# EasyEDA Pro project 2025-07-08.epro, board PCB1
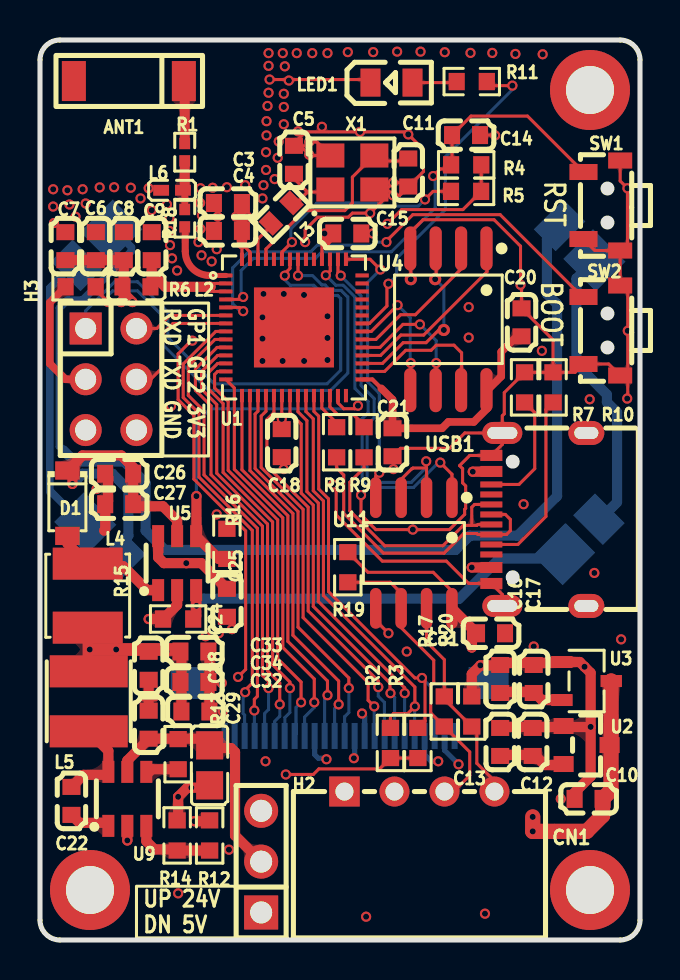
[diagram p1: board, top side]
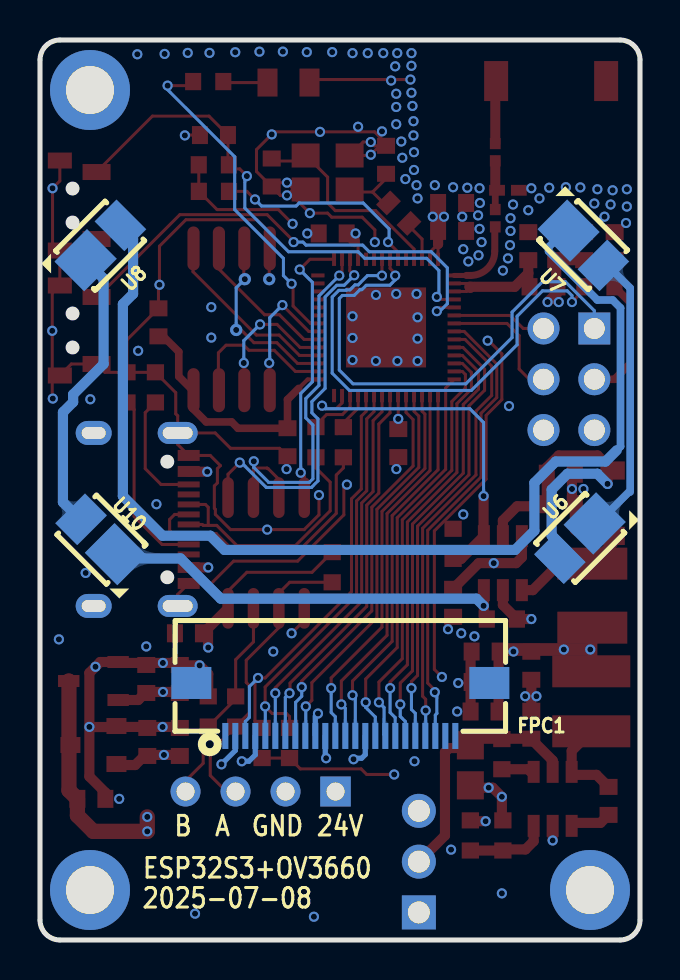
[diagram p2: board, bottom side, seen from below]

Outline 30 x 45 mm; copper layers: Top Layer, Inner1, Inner2, Bottom Layer. Coordinates in mm from the lower left corner of the outline.
Outline path: 0,44 0,1 arc(0.29,0.29) 1,0 29,0 arc(29.71,0.29) 30,1 30,44 arc(29.71,44.71) 29,45 1,45 arc(0.29,44.71) 0,44
Stack: Top Layer 0.035mm 外层铜厚1oz / Dielectric1 0.2104mm 7628 RC49% 8.6mil / Inner1 0.0152mm 内层铜厚 / Dielectric2 1.065mm 1.1mm H/HOZ 含铜 / Inner2 0.0152mm 内层铜厚 / Dielectric3 0.2104mm 7628 RC49% 8.6mil / Bottom Layer 0.035mm 外层铜厚1oz

## Design rules (mm)
net USB_D-: DP1
net USB_D+: DP1
template: 自定义配置
spacing copperThickness1oz (default): track to track 0.102, other pairs 0.152 to 0.3
spacing copperThickness2oz: track to track 0.203, other pairs 0.152 to 0.3
track width copperThickness1oz (default): min 0.127, default 0.254, max 2.54
track width copperThickness2oz: min 0.203, default 0.254, max 2.54
differential pair differentialPair (default): width min 0.127, default 0.254, max 2.54; gap min 0.152, default 0.152
via viaSize (default): diameter min 0.5, default 0.508, max 10; hole min 0.3, default 0.305, max 6.299

## Placement (name value [footprint] x y rotation side)
ANT1  -  [CA-C03]  4.44 42.95 180 top
C3  10nF  [C0603]  9.4 36.85 0 top
C4  1uF  [C0603]  9.4 35.45 0 top
C5  12pF  [C0603]  12.7 39.01 90 top
C6  10uF  [C0603]  2.79 34.69 270 top
C7  1uF  [C0603]  1.27 34.69 270 top
C8  100nF  [C0603]  4.19 34.69 270 top
C9  100nF  [C0603]  5.59 34.69 270 top
C10  10uF  [C0603]  27.43 7.06 0 top
C11  12pF  [C0603]  18.41 38.38 90 top
C12  100nF  [C0603]  24.64 9.9 270 top
C13  10uF  [C0603]  23.01 9.9 270 top
C14  1uF  [C0603]  21.3 40.25 180 top
C15  100nF  [C0603]  15.37 35.33 180 top
C16  100nF  [C0603]  23.01 13.05 270 top
C17  10uF  [C0603]  24.69 13.05 270 top
C18  100nF  [C0603]  12.09 24.84 90 top
C20  100nF  [C0603]  24.08 30.88 270 top
C21  1uF  [C0603]  17.63 24.89 90 top
C22  100nF  [C0603]  1.57 6.95 270 top
C24  10uF  [C0603]  5.43 13.71 90 top
C25  1uF  [C0603]  9.34 16.86 90 top
C26  1uF  [C0603]  3.96 23.31 0 top
C27  1uF  [C0603]  3.96 21.79 0 top
C28  100nF  [C0603]  5.43 10.77 90 top
C29  22uF  [C0805]  8.48 8.73 90 top
C31  100nF  [C0603]  22.55 15.34 0 top
C32  10uF  [C0603]  7.77 11.43 180 top
C33  10uF  [C0603]  7.72 14.42 180 top
C34  10uF  [C0603]  7.72 12.9 180 top
CN1  ZX-XH2.54-4PWZ  [CONN-TH_4P-P2.50_ZX-XH2.54-4PWZ]  18.97 7.42 0 top
D1  1N5819W  [SOD-123_L2.7-W1.6-LS3.7-RD]  1.37 21.84 270 top
FPC1  AFC01-S24FCA-00  [FPC-SMD_24P-P0.50_AFC01-S24FCA-00-R]  14.98 11.53 0 bottom
H2  PZ254V-11-03P  [HDR-TH_3P-P2.54-V-M]  11.06 3.92 90 top
H3  2.54-2*3  [HDR-TH_6P-P2.54-V-R2-C3-S2.54_A2541WV-2X3P]  3.55 28.04 270 top
L2  2nH  [L0603]  4.82 32.66 0 top
L3  24nH  [IND-SMD_L1.6-W0.8]  12.06 36.34 45 top
L4  22uH  [IND-SMD_L4.0-W4.0]  2.39 17.22 90 top
L5  10uH  [IND-SMD_L4.0-W4.0_FNR40XXS]  2.44 11.93 90 top
L6  3nH  [L0402]  6.6 37.49 0 top
LED1  NCD0805R1  [LED0805-R-RD]  17.57 42.87 0 top
NOREF  -  [Pad_e89]  27.5 42.5 0 top
NOREF#2  -  [Pad_e87]  2.5 2.5 0 top
NOREF#3  -  [Pad_e84]  27.5 2.5 0 top
R1  0Ω  [R0402]  7.24 39.39 270 top
R2  4.7kΩ  [R0603]  17.52 9.85 270 top
R3  4.7kΩ  [R0603]  18.9 9.85 270 top
R4  10kΩ  [R0603]  21.31 38.76 0 top
R5  10kΩ  [R0603]  21.3 37.43 0 top
R6  499Ω  [R0603]  2.03 32.66 180 top
R7  5.1kΩ  [R0603]  24.23 27.63 270 top
R8  22Ω  [R0603]  14.83 24.89 90 top
R9  22Ω  [R0603]  16.2 24.89 90 top
R10  5.1kΩ  [R0603]  25.65 27.63 270 top
R11  10kΩ  [R0603]  21.59 42.92 0 top
R12  7.5kΩ  [R0603]  8.48 5.23 90 top
R13  10kΩ  [R0603]  6.91 9.29 90 top
R14  2.4kΩ  [R0603]  6.86 5.23 270 top
R15  5.1Ω  [R0603]  6.91 16.05 0 top
R16  10kΩ  [R0603]  9.34 19.81 270 top
R17  120Ω  [R0603]  20.22 11.43 90 top
R18  0Ω  [R0402]  7.24 36.09 270 top
R19  1kΩ  [R0603]  15.39 18.64 90 top
R20  1kΩ  [R0603]  21.59 11.43 270 top
SW1  TS24CA 250gf 013  [SW-SMD_L4.7-W3.5-P3.35-EH]  28.09 36.72 270 top
SW2  TS24CA 250gf 013  [SW-SMD_L4.7-W3.5-P3.35-EH]  28.09 30.48 270 top
U1  ESP32-S3R8  [QFN-56_L7.0-W7.0-P0.40-TL-EP4.0]  12.7 30.63 0 top
U2  ME6206A28XG  [SOT-23_L2.9-W1.3-P1.90-LS2.4-BR]  27.33 9.75 180 top
U3  ME6206A15XG  [SOT-23-3_L2.9-W1.6-P1.90-LS2.8-BR]  27.33 12.95 180 top
U4  W25Q64JVSSIQ  [SOP-8_L5.3-W5.3-P1.27-LS8.0-BL]  20.42 31.03 180 top
U5  SY7200AABC  [SOT-23-6_L2.9-W1.6-P0.95-LS2.8-BR]  6.86 18.84 270 top
U6  A2835W6H2-D01-8D2AB5  [LED-SMD_L3.5-W2.8-FD-2835_WHITE]  3.14 19.96 135 bottom
U7  A2835W6H2-D01-8D2AB5  [LED-SMD_L3.5-W2.8-FD-2835_WHITE]  2.7 34.6 45 bottom
U8  A2835W6H2-D01-8D2AB5  [LED-SMD_L3.5-W2.8-FD-2835_WHITE]  26.85 34.86 315 bottom
U9  JW5026  [SOT-23-6_L2.9-W1.6-P0.95-LS2.8-BR]  4.37 7.06 270 top
U10  A2835W6H2-D01-8D2AB5  [LED-SMD_L3.5-W2.8-FD-2835_WHITE]  27.07 20.16 225 bottom
U11  SP3485EEN(UMW)  [SOP-8_L5.0-W4.0-P1.27-LS6.0-BL]  18.69 19.35 180 top
USB1  TYPE-C 16PIN 2MD(073)  [usb-c-smd_type-c-6pin-2md-073]  24.94 21.03 90 top
X1  40MHz  [CRYSTAL-SMD_4P-L3.2-W2.5-BL_SIT8008BI]  15.62 38.38 0 top

## Footprints (pads in the part's own frame, mm; a bottom-side part is the same pattern mirrored in y, then rotated)
C0603
  rect 0.8x0.9 smd: 1(-0.7,0) 2(0.7,0)
C0805
  rect 1.41x1.35 smd: 1(-1,0) 2(1,0)
CA-C03
  rect 1.2x2 smd: 1(-2.75,0) 2(2.75,0)
CONN-TH_4P-P2.50_ZX-XH2.54-4PWZ
  rect 1.524x1.5 hole 0.9: 1(-3.75,0)
  round 1.5 hole 0.9: 2(-1.25,0) 3(1.25,0) 4(3.75,0)
CRYSTAL-SMD_4P-L3.2-W2.5-BL_SIT8008BI
  rect 1.4x1.2 smd: 1(-1.1,-0.85) 2(1.1,-0.85) 3(1.1,0.85) 4(-1.1,0.85)
FPC-SMD_24P-P0.50_AFC01-S24FCA-00-R
  rect 0.3x1.3 smd: 1(5.75,1.325) 2(5.25,1.325) 3(4.75,1.325) 4(4.25,1.325) 5(3.75,1.325) 6(3.25,1.325) 7(2.75,1.325) 8(2.25,1.325) 9(1.75,1.325) 10(1.25,1.325) 11(0.75,1.325) 12(0.25,1.325) 13(-0.25,1.325) 14(-0.75,1.325) 15(-1.25,1.325) 16(-1.75,1.325) 17(-2.25,1.325) 18(-2.75,1.325) 19(-3.25,1.325) 20(-3.75,1.325) 21(-4.25,1.325) 22(-4.75,1.325) 23(-5.25,1.325) 24(-5.75,1.325)
  rect 2x1.6 smd: 25(7.449,-1.325) 26(-7.45,-1.325)
HDR-TH_3P-P2.54-V-M
  rect 1.7x1.7 hole 1.1: 1(-2.54,0)
  round 1.7 hole 1.1: 2(0,0) 3(2.54,0)
HDR-TH_6P-P2.54-V-R2-C3-S2.54_A2541WV-2X3P
  rect 1.6x1.6 hole 1.05: 1(-2.54,-1.27)
  round 1.6 hole 1.05: 2(-2.54,1.27) 3(0,-1.27) 4(0,1.27) 5(2.54,-1.27) 6(2.54,1.27)
IND-SMD_L1.6-W0.8
  rect 0.762x1 smd: 1(-0.724,0) 2(0.724,0)
IND-SMD_L4.0-W4.0
  rect 1.6x3.5 smd: 1(-1.6,0) 2(1.6,0)
IND-SMD_L4.0-W4.0_FNR40XXS
  rect 1.6x3.9 smd: 1(-1.5,0) 2(1.5,0)
L0402
  rect 0.79x0.54 smd: 1(-0.545,0) 2(0.545,0)
L0603
  rect 0.8x0.864 smd: 1(-0.7,0) 2(0.7,0)
LED0805-R-RD
  rect 1x1.399 smd: 1(1.05,0) 2(-1.05,0)
LED-SMD_L3.5-W2.8-FD-2835_WHITE
  rect 2.3x2.1 smd: 1(1.231,0)
  rect 1.55x2.1 smd: 2(-1.232,0)
Pad_e84
  round 4 hole 2.4: 1(0,0)
Pad_e87
  round 4 hole 2.4: 1(0,0)
Pad_e89
  round 4 hole 2.4: 1(0,0)
QFN-56_L7.0-W7.0-P0.40-TL-EP4.0
  rect 0.665x0.2 smd: 1(-3.408,2.6) 2(-3.408,2.2) 3(-3.408,1.8) 4(-3.408,1.4) 5(-3.408,1) 6(-3.408,0.6) 7(-3.408,0.2) 8(-3.408,-0.2) 9(-3.408,-0.6) 10(-3.408,-1) 11(-3.408,-1.4) 12(-3.408,-1.8) 13(-3.408,-2.2) 14(-3.408,-2.6) 29(3.408,-2.6) 30(3.408,-2.2) 31(3.408,-1.8) 32(3.408,-1.4) 33(3.408,-1) 34(3.408,-0.6) 35(3.408,-0.2) 36(3.408,0.2) 37(3.408,0.6) 38(3.408,1) 39(3.408,1.4) 40(3.408,1.8) 41(3.408,2.2) 42(3.408,2.6)
  rect 0.2x0.665 smd: 15(-2.6,-3.408) 16(-2.2,-3.408) 17(-1.8,-3.408) 18(-1.4,-3.408) 19(-1,-3.408) 20(-0.6,-3.408) 21(-0.2,-3.408) 22(0.2,-3.408) 23(0.6,-3.408) 24(1,-3.408) 25(1.4,-3.408) 26(1.8,-3.408) 27(2.2,-3.408) 28(2.6,-3.408) 43(2.6,3.408) 44(2.2,3.408) 45(1.8,3.408) 46(1.4,3.408) 47(1,3.408) 48(0.6,3.408) 49(0.2,3.408) 50(-0.2,3.408) 51(-0.6,3.408) 52(-1,3.408) 53(-1.4,3.408) 54(-1.8,3.408) 55(-2.2,3.408) 56(-2.6,3.408)
  rect 4x4 smd: 57(0,0)
R0402
  rect 0.566x0.54 smd: 1(-0.433,0) 2(0.433,0)
R0603
  rect 0.806x0.864 smd: 1(-0.753,0) 2(0.753,0)
SOD-123_L2.7-W1.6-LS3.7-RD
  rect 0.91x1.22 smd: 1(-1.635,0) 2(1.635,0)
SOP-8_L5.0-W4.0-P1.27-LS6.0-BL
  oval 0.574x2.035 smd: 1(-1.905,-2.768) 2(-0.635,-2.768) 3(0.635,-2.768) 4(1.905,-2.768) 5(1.905,2.768) 6(0.635,2.768) 7(-0.635,2.768) 8(-1.905,2.768)
SOP-8_L5.3-W5.3-P1.27-LS8.0-BL
  oval 0.609x2.204 smd: 1(-1.905,-3.542) 2(-0.635,-3.542) 3(0.635,-3.542) 4(1.905,-3.542) 5(1.905,3.542) 6(0.635,3.542) 7(-0.635,3.542) 8(-1.905,3.542)
SOT-23-3_L2.9-W1.6-P1.90-LS2.8-BR
  rect 1.07x0.6 smd: 1(1.235,-0.95) 2(1.235,0.95) 3(-1.235,0)
SOT-23-6_L2.9-W1.6-P0.95-LS2.8-BR
  rect 1.1x0.6 smd: 1(1.35,-0.95) 2(1.35,0) 3(1.35,0.95) 4(-1.35,0.95) 5(-1.35,0) 6(-1.35,-0.95)
SOT-23_L2.9-W1.3-P1.90-LS2.4-BR
  rect 1x0.8 smd: 1(1.15,-0.95) 2(1.15,0.95) 3(-1.15,0)
SW-SMD_L4.7-W3.5-P3.35-EH
  rect 0.8x1.4 smd: 1(-1.675,-0.917) 2(1.675,-0.917)
  rect 0.8x1.2 smd: 3(-2.25,0.917) 4(2.25,0.917)
usb-c-smd_type-c-6pin-2md-073
  rect 0.55x1.1 smd: 1(-3.2,2.375) 2(-2.4,2.375) 11(2.4,2.375) 12(3.2,2.375)
  rect 0.3x1.1 smd: 3(-1.75,2.375) 4(-1.25,2.375) 5(-0.75,2.375) 6(-0.25,2.375) 7(0.25,2.375) 8(0.75,2.375) 9(1.25,2.375) 10(1.75,2.375)
  oval 1.1x2 hole 0.6x1.5: 13(-4.325,1.825) 14(4.325,1.825)
  oval 1.2x1.8 hole 0.6x1.2: 13(-4.325,-2.375) 14(4.325,-2.375)

## Nets
As in the schematic, except:
GND: C3.1 C4.1 C5.2 C6.1 C7.1 C8.1 C9.1 C10.1 C11.1 C12.1 C13.1 C14.1 C15.1 C16.1 C17.1 C18.1 C20.1 C21.1 C24.1 C25.1 C26.1 C27.1 C28.2 C29.1 C31.2 C32.1 C33.1 C34.1 CN1.2 FPC1.2 FPC1.15 FPC1.25 FPC1.26 H3.5 L6.1 LED1.2 NOREF.1 NOREF#2.1 NOREF#3.1 R7.1 R10.1 R14.1 R15.1 R16.1 R20.1 SW1.2 SW1.3 SW1.4 SW2.2 SW2.3 SW2.4 U1.57 U2.1 U3.1 U4.4 U5.2 U9.2 U11.5 USB1.1 USB1.12 USB1.13 USB1.14 X1.2 X1.4

Pads without a net: ANT1 2; FPC1 1 23 24; U1 28 37 38 39 40 41 42 47 48 52; USB1 3 9

## Via types
v1: diameter 0.508, hole 0.305, Top Layer to Bottom Layer, 157 vias
v2: diameter 0.508, hole 0.299, Top Layer to Bottom Layer, 43 vias
v3: diameter 0.61, hole 0.305, Top Layer to Bottom Layer, 3 vias

## Routing (per net, layer and track width the routed paths; a pad name or vN(x,y) marks a point on that pad's centre or on a via; arc(x,y) is an arc through that point)
5V: length 1.9
  Top Layer w0.508: v2(21.64,23.41) 22.55,23.41 USB1.11 ; v2(21.59,18.63) USB1.2
24V_5V: length 12.9
  Top Layer w0.508: H2.2 9.75,5.22 9.75,9.39 9.55,9.6 8.62,9.6 C29.2 8.15,10.06 C28.1 5.43,10.04 4.37,8.97 4.37,8.26
GND: length 156.2
  Top Layer w0.152: USB1.13 23.12,17.28 USB1.1 21.44,17.83 20.32,18.94 17.12,18.94 14.81,21.25 14.81,22.62 v1(14.66,22.77) ; v1(17.65,37.23) 17.4,37.23 v1(16.51,36.34) 15.62,36.34 15.42,36.14 13.89,36.14 13.26,35.5 v1(13.26,34.89) ; v1(17.65,37.23) 17.97,37.23 ; v1(17.65,37.23) 17.36,37.53 17.31,37.53 ; LED1.2 16.37,43.02 v1(11.48,43.02) ; R10.1 25.65,30.01 C20.1 24.08,32.71 v2(24.03,32.76) 24.03,34.69 22.71,36.01 19.15,36.01 18.48,35.35 18.48,33.57 ; R10.1 26.76,28.38 SW2.2 28.43,28.8 SW2.4 ; R10.1 R7.1 23.21,27.37 23.21,26.31 23.12,26.21 USB1.14 ; C14.1 22.74,40.25 v1(22.76,40.23) ; v2(9.09,12.85) 8.47,12.85 C34.1 ; U11.5 16.79,15.97 v1(17.42,15.34) ; 13.01,39.71 13.27,39.71 v1(13.46,39.9) 13.84,39.9 X1.4 13.5,39.22 v1(13.46,39.26) 13.01,39.71 ; 13.01,39.71 12.57,39.71 13.27,40.41 v1(16,40.41) 18.29,40.41 v1(18.41,40.28) 19.18,39.52 19.18,38.43 17.98,37.23 17.97,37.23 ; 17.97,37.23 C11.1 18.22,37.87 v1(17.65,37.87) 17.31,37.53 ; SW1.4 SW2.3 29.39,32.35 v1(29.39,30.46) 29.39,27.1 v1(29.36,27.07) ; SW1.4 27.75,34.47 SW1.2 ; SW1.4 29.37,34.84 v1(29.37,37.59) 29.01,37.95 SW1.3 ; C21.1 18.02,24.58 20.47,24.58 21.24,25.35 USB1.14 ; 17.31,37.53 X1.2 ; v2(9.9,13.15) 10.28,13.53 10.28,20.45 7.69,23.04 7.69,26.23 6.91,27.02 6.91,29.31 7.57,29.97 v1(7.62,29.97) ; USB1.14 23.12,24.78 USB1.12 21.49,24.23 20.98,23.72 21.13,23.57 21.13,22.86 21.28,22.7 21.28,21.59 21.23,21.53 21.23,21.28 20.47,20.52 v1(18.64,20.52) 16.79,20.52 16.05,21.26 v1(16.05,22.25) ; v3(18.54,33.04) 18.54,34.55
  Top Layer w0.508: R14.1 6.91,6.03 v2(6.91,7.16) 7.36,7.62 v2(7.57,7.62) 8.36,7.62 C29.1 ; v1(27.53,10.66) 27.53,10.65 26.25,10.65 26.24,10.65 v1(23.87,10.65) 23.01,10.65 ; v1(27.53,10.66) 27.53,13.36 v1(27.23,13.66) 26.99,13.9 26.19,13.9 26.15,13.85 v1(23.86,13.85) 22.96,13.85 22.84,13.73 v1(22.02,13.73) 21.59,13.3 R20.1 ; v1(27.53,10.66) 27.53,8.17 26.73,7.37 C10.1 ; v2(5.43,16.05) R15.1 6.86,16.75 U5.2 ; 3.21,20.47 3.26,20.52 C27.1 3.4,21.93 v1(3.4,22.55) 3.4,23.17 C26.1 ; v2(4.37,4.98) 4.37,5.86 ; C32.1 8.47,14.37 C33.1 ; C24.1 C28.2
  Bottom Layer w0.254: v1(20.93,8.78) 20.23,9.48 FPC1.2 ; v1(14.32,9.04) 14.27,9.09 13.92,9.09 13.73,9.27 FPC1.15
  vias: v1(0.66,37.54) v1(0.66,36.67) v1(0.7,35.85) v1(1.37,37.49) v1(1.47,36.78) v1(1.78,36.17) v1(2.13,37.54) v1(2.28,36.83) v1(2.83,22.55) v1(2.98,37.63) v1(3.71,37.64) v1(4.54,37.61) v1(5.03,37.08) v1(5.43,37.59) v1(5.59,36.49) v1(6.35,36.78) v1(6.47,36.09) v1(6.47,35.45) v1(6.5,34.74) v1(6.6,34.08) v1(6.55,26.7) v1(6.86,33.47) v1(6.91,2.33) v1(7.92,34.89) v1(8.02,37.59) v1(8.01,36.85) v1(8.02,35.56) v1(8.1,36.23) v1(8.07,34.23) v1(8.63,37.61) v1(8.58,33.93) v1(8.84,34.54) v1(8.84,21.28) v1(8.89,36.17) v1(9.14,11.43) v1(9.34,37.64) v1(9.45,4.52) v1(10.26,37.74) v1(11.12,37.08) v1(11.12,30.07) v1(11.12,28.95) v1(11.17,37.74) v1(11.33,40.94) v1(11.33,40.23) v1(11.3,39.39) v1(11.3,38.5) v1(11.28,8.94) v1(11.43,44.34) v1(11.43,43.71) v1(11.43,42.36) v1(11.38,41.7) v1(11.73,38.05) v1(11.94,39.92) v1(11.88,39.11) v1(12.14,44.34) v1(12.13,28.95) v1(12.24,43.68) v1(12.19,42.31) v1(12.19,41.65) v1(12.19,40.79) v1(12.19,32.3) v1(12.18,23.55) v1(12.44,42.97) v1(12.84,44.34) v1(12.9,40.43) v1(13.2,32.25) v1(13.21,28.95) v1(13.61,44.34) v1(14.09,40.66) v1(14.37,44.34) v1(14.37,31.19) v1(14.37,30.1) v1(14.37,29) v1(15.39,44.39) v1(16.31,1.16) v1(16.63,35.33) v1(16.66,44.39) v1(17.67,23.54) v1(17.86,44.42) v1(18.34,14.42) v1(19.03,44.42) v1(20.24,44.39) v1(21.44,31.64) v1(21.53,44.35) v1(22.25,1.32) v1(22.61,44.35) v1(23.77,44.3) v1(24.18,21.79) v1(24.69,14.68) v1(25.13,44.29) v1(25.09,29.46) v1(26.04,7.06) v1(29.06,15.03) v2(5.18,12.19) v2(5.74,12.19) v2(8.28,15.19) v2(8.94,15.34) v2(9.6,15.54) v2(11.12,31.14) v2(11.17,32.3) v2(21.44,30.12) v2(27.49,27.04) v2(27.72,18.35)
VDD3P3: length 6.8
  Top Layer w0.152: 8.49,32.61 8.67,32.43 U1.3 ; 8.44,32.66 8.27,32.83 U1.2
  Top Layer w0.508: 8.49,32.61 8.48,32.62 8.52,32.66 6.26,32.66 5.59,33.34 ; 5.59,33.34 5.59,32.72 L2.2 ; 5.59,33.34 C9.2
VDD_SPI: length 13
  Top Layer w0.203: 17.07,27.58 16.62,28.03 U1.29
  Top Layer w0.381: C20.2 23.83,30.18 23.06,29.41 23.06,28.18 22.35,27.47 22.35,26.56 21.69,25.9 20.42,25.9 20.1,25.59 C21.2 17.63,27.02 17.07,27.58
1P5V: length 4.6
  Top Layer w0.508: 26.19,12 25.09,12 24.69,12.4 v1(23.85,12.4) 23.01,12.4 22.96,12.45
  Bottom Layer w0.254: v2(16.1,11.32) 16.23,11.19 FPC1.10
2P8V: length 6.4
  Top Layer w0.508: 23.01,9.25 v1(23.8,9.25) 24.64,9.25 24.69,9.3 25.24,8.75 26.25,8.75
  Bottom Layer w0.254: v2(19.91,8.94) 19.56,8.94 19.23,9.26 FPC1.4 ; v2(15.69,9.09) 15.73,9.13 FPC1.11
3P3V: length 65
  Top Layer w0.152: v1(10.36,36.17) 10.36,36.59 C3.2 ; R3.2 R2.2 16.98,8.56 13.94,8.56 13.66,8.28 v1(12.29,8.28) ; R19.2 16.4,18.39 19.66,18.39 20.57,17.47 20.57,16.61 U11.8 ; v1(17.37,35.81) 18.08,36.52 21.15,36.52 R5.2 22.06,37.44 R4.2 ; 14.66,35.33 v1(14.22,35.33) 14.1,35.2 U1.46 ; U1.56 10.1,34.8 10.5,34.4 U1.55 ; U1.20 12.09,27.21 v1(12.09,26.06) 12.09,25.55 C18.2
  Top Layer w0.508: 4.82,25.59 5.01,25.59 ; 4.82,25.59 4.82,25.62 ; 4.82,25.59 4.55,25.59 4.4,25.45 ; 4.19,32.33 4.19,32.03 v1(4.06,31.9) ; 4.19,32.33 4.12,32.39 L2.1 ; 4.19,32.33 v1(4.62,31.9) ; C33.2 7.07,14.37 C32.2 ; v1(21.59,14.63) 21.6,14.64 21.6,15.58 U11.8 ; 4.19,32.72 C8.2 C6.2 C7.2 ; L4.1 2.39,13.48 2.44,13.43 ; C25.2 8.06,18.84 v1(7.31,18.84) 6.2,18.84 5.91,19.13 U5.6 ; R12.2 8.44,5.94 v2(7.72,5.94) ; 14.27,34.89 14.27,34.94 14.66,35.33 ; C3.2 C4.2 10.1,34.8 10.1,34.8
  Top Layer w0.635: v2(2.49,14.52) v2(3.81,14.52) 6.92,14.52 C33.2
  Top Layer w0.762: v1(24.64,6.16) v1(24.64,5.43) 27.34,5.43 28.13,6.23 C10.2 28.55,7.48 28.55,12.94 U3.3
  vias: v1(6.33,14.42) v1(9.8,36.17)
485_A: length 15.2
  Top Layer w0.152: 20.22,7.42 20.68,7.42 21.49,8.22 21.49,9.4 R17.1 19.53,11.35 19.53,12.73 19.69,12.88 19.69,13.99 18.06,15.62 U11.6 18.06,17.34 17.52,17.89 R19.1
485_B: length 10.6
  Top Layer w0.152: CN1.4 22.72,7.95 21.84,8.83 21.84,10.42 R20.2 20.22,12.04 R17.2 20.22,14.02 19.33,14.91 U11.7
485_EN: length 19.8
  Top Layer w0.152: 19.33,23.6 19.31,23.61 v1(19.31,23.94) ; 19.33,23.6 U11.2 ; 19.33,23.6 18.65,23.6 18.62,23.57 18.59,23.57 18.06,23.03 U11.3 ; v1(15.04,33.22) 14.9,33.36 U1.44
  Bottom Layer w0.152: v1(19.31,23.94) 19.31,23.63 18.57,22.88 16.53,22.88 16.36,23.06 16.36,25.75 16.71,26.11 16.71,27.07 16.05,27.73 16.05,32.2 v1(15.04,33.22)
BOOT: length 23.8
  Top Layer w0.152: v1(17.32,34.89) 17.32,34.95 18.64,36.27 23.01,36.27 27.17,32.1 ; v2(10.16,31.44) 9.97,31.63 U1.5
  Bottom Layer w0.152: v2(10.16,31.44) 10.01,31.44 9.63,31.81 9.63,33.61 10.44,34.41 13.54,34.41 13.87,34.74 16.7,34.74 16.85,34.89 v1(17.32,34.89)
D2: length 21.5
  Top Layer w0.152: U1.11 8.88,29.23 8.07,28.42 8.07,27.54 8.84,26.78 8.84,23.34 11.38,20.8 11.38,13.46 11.99,12.85 v2(11.99,11.78)
  Bottom Layer w0.152: FPC1.19 11.73,10.93 11.99,11.18 v2(11.99,11.78)
D3: length 22.4
  Top Layer w0.152: U1.9 8.75,30.03 7.41,28.69 7.41,27.23 8.2,26.44 8.2,23.25 10.87,20.59 10.87,12.19 10.72,12.03 v1(10.72,11.48)
  Bottom Layer w0.152: FPC1.21 10.72,10.22 v1(10.72,11.48)
D4: length 22.8
  Top Layer w0.152: 10.36,12.59 10.62,12.85 10.62,20.48 7.95,23.15 7.95,26.34 7.16,27.12 7.16,28.8 8.79,30.43 U1.8
  Bottom Layer w0.152: FPC1.22 10.23,11.25 10.16,11.32 10.16,12.29 v2(10.26,12.39)
D5: length 21.9
  Top Layer w0.152: v2(11.43,12.59) 11.43,12.92 11.12,13.23 11.12,20.69 8.55,23.26 8.55,26.7 7.77,27.49 7.77,28.55 8.85,29.63 U1.10
  Bottom Layer w0.152: FPC1.20 11.23,11.33 11.43,11.53 v2(11.43,12.59)
D6: length 21
  Top Layer w0.152: v2(12.5,12.59) 12.5,12.9 11.63,13.76 11.63,20.9 9.16,23.38 9.16,26.82 8.43,27.54 8.43,28.38 8.88,28.83 U1.12
  Bottom Layer w0.152: v2(12.5,12.59) 12.5,11.38 12.24,11.12 12.24,10.21 FPC1.18
D7: length 19.9
  Top Layer w0.152: v2(13.71,11.88) 13.71,13.05 12.14,14.63 12.14,21.11 9.72,23.53 9.72,27.6 U1.14
  Bottom Layer w0.152: v2(13.71,11.88) 13.71,11.63 13.23,11.15 FPC1.16
D8: length 18.8
  Top Layer w0.152: v2(14.37,12.24) 14.37,12.95 12.39,14.93 12.39,21.22 10.1,23.51 U1.15
  Bottom Layer w0.152: v2(14.37,12.24) 14.23,12.1 FPC1.14
D9: length 19.1
  Top Layer w0.152: U1.17 10.9,26.44 10.75,26.3 10.75,23.57 12.9,21.43 12.9,15.64 15.44,13.1 v2(15.44,12.59)
  Bottom Layer w0.152: FPC1.12 15.23,11.17 15.44,11.38 v2(15.44,12.59)
GPIO1: length 5.3
  Top Layer w0.152: U1.6 6.49,31.23 5.84,30.58 4.82,30.58
  Bottom Layer w0.152: 4.32,30.58 4.88,30.58
GPIO2: length 6.6
  Top Layer w0.152: U1.7 6.65,30.83 6.04,30.22 6.04,28.55 5.53,28.04 H3.4
HREF: length 19.5
  Top Layer w0.152: U1.18 11.3,26.43 11.06,26.2 11.06,23.63 13.16,21.53 13.16,16.12 16.41,12.87 16.41,11.98 v2(16.71,11.68)
  Bottom Layer w0.152: v2(16.71,11.68) 16.71,10.22 FPC1.9
LED: length 16.5
  Top Layer w0.152: U1.36 16.47,30.83 17.35,31.7 17.35,32.74 v1(17.42,32.81) ; v1(23.62,42.72) 22.29,42.72
  Bottom Layer w0.152: v1(23.62,42.72) 23.62,42.52 20.27,39.16 20.27,36.52 17.83,34.08 17.83,33.22 v1(17.42,32.81)
LED_N: length 20.7
  Top Layer w0.508: R15.2 7.81,16.19 U5.3
  Bottom Layer w0.508: v1(7.82,16.71) 8.18,17.06 20.96,17.06 22.97,19.08 26.04,19.08
LED_P: length 16.6
  Top Layer w0.508: U5.5 6.86,20.98 6.15,21.69 4.76,21.69 C27.2 C26.2 4.66,23.63 4.06,24.23 2.12,24.23 D1.1 1.62,23.22 v1(1.62,22.81)
  Bottom Layer w0.508: 3.62,19.33 3.62,19.42 4.42,20.21 4.42,22.52 3.62,23.31 2.13,23.31 v1(1.62,22.81)
LED_PWM: length 17.7
  Top Layer w0.152: U1.27 14.9,26.85 15.19,26.56 15.75,26.56 v1(15.9,26.72)
  Top Layer w0.508: v1(7.82,22.19) 7.82,20.21 U5.4 8.94,19.05 R16.2
  Bottom Layer w0.152: v1(7.82,22.19) 7.82,25.88 8.51,26.56 15.75,26.56 v1(15.9,26.72)
PCLK: length 20.6
  Top Layer w0.152: v2(13.05,11.88) 13.05,12.9 11.88,14.07 11.88,21.01 9.41,23.48 9.41,26.92 8.73,27.6 8.73,28.28 8.88,28.43 U1.13
  Bottom Layer w0.152: FPC1.17 12.8,10.27 12.8,11.63 v2(13.05,11.88)
PWDN: length 19.6
  Top Layer w0.152: v2(16.91,12.64) 16.91,12.95 13.41,16.45 13.41,21.64 11.35,23.7 11.35,26.02 11.7,26.38 U1.19
  Bottom Layer w0.152: v2(16.91,12.64) 16.91,12.19 17.22,11.88 17.22,10.22 FPC1.8
RESET: length 25.7
  Top Layer w0.152: SW1.1 24.38,41.19 21.55,41.19 C14.2 20.6,38.81 R4.1 20.35,38.55 20.01,38.55 v1(19.66,38.2) ; U1.4 10.03,32.03 v2(10.16,32.15)
  Bottom Layer w0.152: 19.71,38.2 19.76,38.15 19.76,36.6 17.57,34.41 14.1,34.41 13.77,34.08 10.67,34.08 10.06,33.47 10.06,32.3 10.21,32.15
RESETB: length 19.2
  Top Layer w0.152: U1.22 12.9,26.42 13.35,25.97 13.35,22.42 13.92,21.85 13.92,16.92 18.24,12.61 v2(18.24,12.34)
  Bottom Layer w0.152: 18.23,12.34 FPC1.6
RXD: length 19
  Top Layer w0.152: 14.51,34.06 14.51,33.46 v1(14.29,33.24) ; U11.1 20.6,23.29 v1(20.01,23.87)
  Bottom Layer w0.152: v1(20.01,23.87) 19.93,23.87 18.68,22.63 16.43,22.63 16.1,22.95 16.1,26.06 16.41,26.36 16.41,26.92 15.75,27.58 15.75,32.15 15.16,32.74 14.79,32.74 v1(14.29,33.24)
SIO_C: length 21.3
  Top Layer w0.152: U1.23 13.3,26.42 13.66,26.06 13.66,22.46 14.17,21.95 14.17,17.22 18.74,12.65 v2(18.74,11.68) 18.39,11.32 17.68,11.32 17.52,11.17 R2.1
  Bottom Layer w0.152: v2(18.74,11.68) 18.73,11.67 FPC1.5
SIO_D: length 22.4
  Top Layer w0.152: U1.24 13.7,26.43 13.94,26.19 13.94,22.55 14.43,22.06 14.43,17.42 18.74,13.1 v2(19.1,13.1) 19.25,12.95 19.25,10.96 R3.1
  Bottom Layer w0.152: v2(19.1,13.1) 19.53,12.67 19.53,11.13 19.73,10.93 FPC1.3
SPICLK: length 7
  Top Layer w0.152: v1(19,30.78) 18.15,30.78 17,29.63 U1.33 ; v1(19.81,28.85) 19.81,27.47
  Bottom Layer w0.152: v1(19.81,28.85) 19.81,29.97 v1(19,30.78)
SPICS0: length 9.1
  Top Layer w0.152: 22.35,34.55 22.35,33.41 19.18,30.25 18.05,30.25 17.03,29.23 U1.32
SPID: length 6.9
  Top Layer w0.152: v1(17.88,31.75) 16.56,30.43 U1.35 ; v2(18.54,28.85) 18.54,27.47
  Bottom Layer w0.152: v1(17.88,31.75) 18.51,31.11 18.51,28.88 v2(18.54,28.85)
SPIHD: length 7.6
  Top Layer w0.152: U1.30 17.23,28.43 18.29,29.48 19.56,29.48 19.81,29.74 20.7,29.74 21.08,29.36 21.08,27.47
SPIQ: length 7.4
  Top Layer w0.152: 21.08,34.55 21.08,33.57 18.77,31.26 18.03,31.26 16.8,30.03 U1.34
SPIWP: length 9.1
  Top Layer w0.152: v3(20.19,30.5) 19.94,30.5 19.3,29.87 18.16,29.87 17.12,28.83 U1.31 ; v3(19.76,33.04) 19.81,33.04 19.81,34.55
  Bottom Layer w0.152: v3(19.76,33.04) 20.19,32.61 v3(20.19,30.5)
TXD: length 13.9
  Top Layer w0.152: v1(17.02,33.52) 16.5,34.04 U1.43 ; v1(16.97,23.36) 16.79,23.19 U11.4
  Bottom Layer w0.152: v1(17.02,33.52) 16.38,32.89 16.38,27.91 16.97,27.33 v1(16.97,23.36)
U0RX: length 25.5
  Top Layer w0.152: v1(12.24,33.22) 12.24,33.32 12.5,33.58 U1.50
  Bottom Layer w0.152: v1(12.24,33.22) 12.24,33 12.51,32.74 13.69,32.74 13.91,32.52 14,32.52 14.29,32.23 14.88,32.23 15.03,32.08 15.03,28.49 14.35,27.81 8.71,27.81 6.4,30.12 6.4,31.39 4.88,32.91 3.74,32.91 2.28,31.46 2.28,31.08 1.78,30.58
U0TX: length 5.8
  Top Layer w0.381: R6.2 0.49,31.87 0.49,28.82 1.28,28.04 1.78,28.04
USB_D+: length 13.2
  Top Layer w0.152: 21.57,20.73 21.59,20.75 21.59,21.64 21.73,21.78 USB1.8 ; 21.57,20.73 21.16,20.73 20.15,19.71 17.24,19.71 15.49,21.46 15.49,22.89 16.2,23.6 R9.1 ; 21.57,20.73 21.84,20.73 21.89,20.78 USB1.6
USB_D-: length 14.2
  Top Layer w0.152: USB1.7 23.27,21.28 23.52,21.03 23.52,20.47 23.33,20.28 USB1.5 21.89,20.28 21.84,20.32 21.19,20.32 20.21,19.34 17.18,19.34 15.19,21.33 15.19,23.25 14.83,23.6 R8.1
USB_R_D+: length 2.6
  Top Layer w0.152: 16.42,25.52 15.67,26.27 14.88,26.27 14.49,26.66 14.49,26.89
USB_R_D-: length 2.4
  Top Layer w0.152: 14.09,27.26 14.09,26.59 15.14,25.55 15.14,25.32
VSYNC: length 19.2
  Top Layer w0.152: U1.21 12.5,26.36 13.06,25.8 13.06,22.35 13.66,21.74 13.66,16.68 17.5,12.84 17.5,12.36 v2(17.52,12.34)
  Bottom Layer w0.152: FPC1.7 17.73,12.13 v2(17.52,12.34)
XVCLK: length 18.9
  Top Layer w0.152: U1.16 10.5,23.47 12.65,21.32 12.65,15.24 14.93,12.95 v2(14.93,11.78)
  Bottom Layer w0.152: v2(14.93,11.78) 14.73,11.58 FPC1.13
$1N788: length 6
  Top Layer w0.152: USB1.10 23.95,22.78 24.74,23.57 24.74,26.37 R7.2
$1N789: length 9.2
  Top Layer w0.152: USB1.4 23.89,19.78 25.3,21.18 25.3,26.52 R10.2
$1N1772: length 2.1
  Top Layer w0.152: 11.68,35.7 11.56,35.7 10.9,35.05 U1.54
$1N1802: length 10.2
  Top Layer w0.152: U1.53 11.3,34.55 13.22,36.47 15.24,36.47 15.62,36.85 15.62,38.14 16.42,38.95 18.41,38.95
$1N1812: length 3
  Top Layer w0.152: 13.37,37.4 12.57,38.2 12.57,38.31 ; 13.37,37.4 12.83,36.86 12.57,36.86 ; 13.37,37.4 14.14,37.4
$1N4260: length 10.7
  Top Layer w0.152: v1(12.6,34.89) 12.1,34.4 U1.51 ; v1(19.25,37.03) 19.65,37.43 20.55,37.43
  Bottom Layer w0.152: v1(12.6,34.89) 12.55,34.95 12.55,35.56 13.84,36.85 17.04,36.85 17.19,36.7 18.92,36.7 v1(19.25,37.03)
$1N4634: length 24.2
  Top Layer w0.152: v1(12.9,33.22) 12.9,34.03 U1.49 ; v1(3.4,31.9) 2.78,32.52 R6.1
  Bottom Layer w0.152: v1(12.9,33.22) 13.63,33.22 14.09,32.76 14.25,32.76 14.5,32.51 14.68,32.51 14.69,32.48 15.05,32.48 15.39,32.15 15.39,28.34 14.53,27.48 8.43,27.48 6.15,29.76 6.15,31.19 4.88,32.46 3.64,32.46 3.4,32.22 v1(3.4,31.9)
$1N5382: length 3.1
  Top Layer w0.5: R1.1 7.24,42.9
$1N7842: length 1.7
  Top Layer w0.508: 5.32,8.26 5.6,8.54 R13.1
$1N7844: length 4.7
  Top Layer w0.508: 2.44,10.44 3.42,9.45 3.42,8.26 2.17,8.26 C22.1
$1N7845: length 2
  Top Layer w0.508: C22.2 1.97,5.86 3.42,5.86
$1N8031: length 4.3
  Top Layer w0.508: 5.32,5.86 5.32,4.94 5.73,4.53 7.01,4.53 7.06,4.47 R12.1
$1N9498: length 5.9
  Top Layer w0.508: D1.2 1.37,19.83 L4.2 2.51,18.69 4.16,18.69 5.36,17.49 U5.1
$1N9979: length 57
  Bottom Layer w0.381: 3.72,35.68 3.72,35.49 4.57,34.64 4.57,34.44 2.13,32 1.37,32 0.97,31.6 0.97,24.67 1.17,24.48
  Bottom Layer w0.508: 25.98,35.68 25.35,35.05 25.35,32.3 25.85,31.8 25.85,22.19 23.87,20.21 21.49,20.21 20.78,19.5 6.25,19.5 5.28,20.47 5.28,22.86 4.21,23.92 1.72,23.92 1.17,24.48 ; 26.11,35.29 26.24,35.42
$1N9982: length 14.3
  Bottom Layer w0.381: 0.49,22.4 0.49,32.59 2.02,34.12 ; 1.96,20.99 0.55,22.4
$1N9996: length 15.2
  Bottom Layer w0.508: 27.93,34.19 26.82,33.08 26.82,28.8 28.34,27.28 28.34,26.89 28.85,26.39 28.85,21.89 27.7,20.74
$1N10529: length 2.2
  Top Layer w0.152: 18.62,42.87 20.78,42.87 R11.1
$1N11616: length 4
  Top Layer w0.254: 8.68,33.23 U1.1
  Top Layer w0.349: 8.47,33.23 arc(7.62,33.58) 7.26,34.44
  Top Layer w0.35: 8.47,33.23 8.68,33.23 ; 7.26,34.44 7.26,35.63 arc(7.26,35.65) R18.2
$1N11617: length 2.5
  Top Layer w0.34: R18.1 7.24,37.4 arc(7.21,37.46) L6.2
  Top Layer w0.5: R1.2 7.24,37.56 7.28,37.51

## Copper pours and planes (outline as drawn; the poured copper is in the pictures)
5V on Inner2: 9.75,24.14 29.74,24.14 29.74,0.26 9.75,0.26
24V on Inner2: 9.83,8.4 16.38,8.4 16.38,5.61 9.83,5.61
GND on Top Layer: -0.38,45.49 30.5,45.49 30.5,-0.59 -0.38,-0.59
GND on Bottom Layer: -0.66,45.46 30.58,45.46 30.58,-0.72 -0.66,-0.72
GND on Inner1: 0.26,44.74 29.74,44.74 29.74,0.26 0.26,0.26
GND on Inner2: 0.26,44.74 29.74,44.74 29.74,24.39 0.26,24.39
1P5V on Inner2: 15.47,13.84 25.47,13.84 25.47,10.54 15.47,10.54
2P8V on Inner2: 15.47,10.28 25.47,10.28 25.47,8.66 15.47,8.66
3P3V on Inner2: 0.26,36.49 25.47,36.49 25.47,0.26 0.26,0.26

Small or netless copper shapes (teardrops, artwork), in the pictures only: 367 on Top Layer, 68 on Bottom Layer, 16 on Inner1, 7 on Inner2

## Text on the board
Bottom Silkscreen Layer: 24V | GND | A | B | ESP32S3+OV3660 | 2025-07-08
Top Silkscreen Layer: GP1 GP2 3V3 / RXD TXD GND | UP 24V / DN 5V | BOOT | RST
